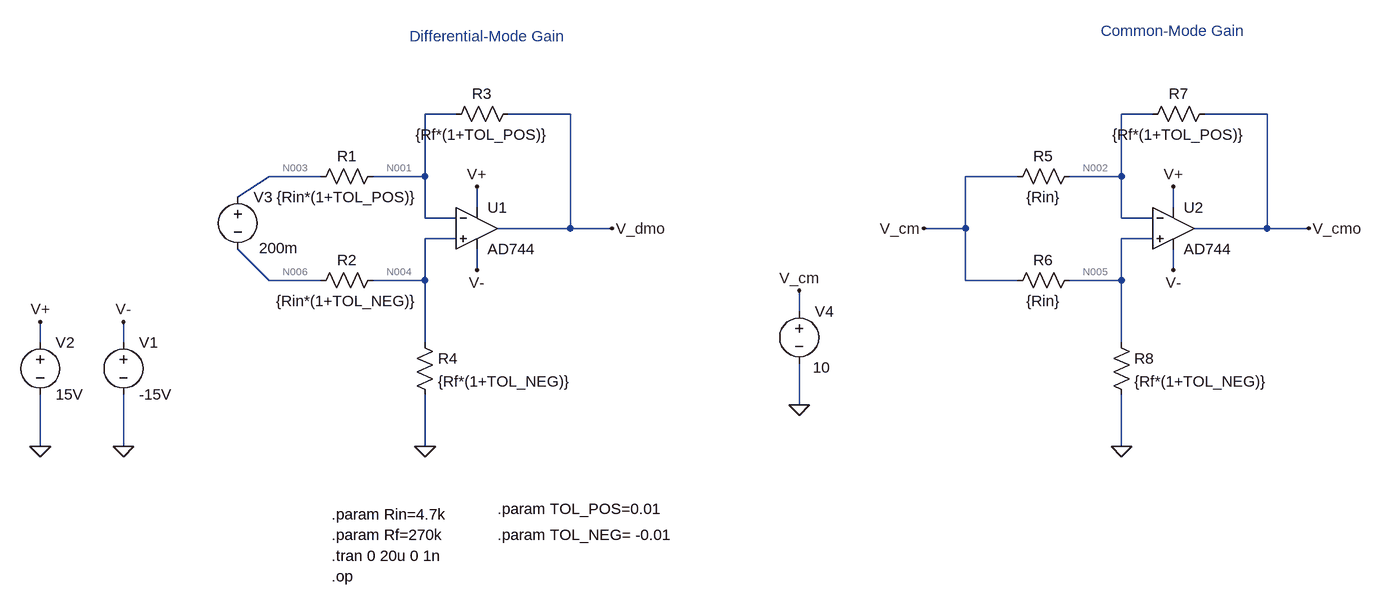
[diagram p0: schematic hw3_p3c_vcm10v_eantunano.asc]
hw3_p3c_vcm10v_eantunano.asc, the LTspice schematic file:
Version 4
SHEET 1 1632 696
WIRE 208 -32 160 -32
WIRE 384 -32 288 -32
WIRE 1280 -32 1232 -32
WIRE 1456 -32 1360 -32
WIRE 0 64 -80 64
WIRE 160 64 160 -32
WIRE 160 64 80 64
WIRE 1072 64 992 64
WIRE 1232 64 1232 -32
WIRE 1232 64 1152 64
WIRE -128 96 -80 64
WIRE 240 112 240 80
WIRE 1312 112 1312 80
WIRE 160 128 160 64
WIRE 208 128 160 128
WIRE 1232 128 1232 64
WIRE 1280 128 1232 128
WIRE 384 144 384 -32
WIRE 384 144 272 144
WIRE 448 144 384 144
WIRE 992 144 992 64
WIRE 992 144 928 144
WIRE 1456 144 1456 -32
WIRE 1456 144 1344 144
WIRE 1520 144 1456 144
WIRE 208 160 160 160
WIRE 1280 160 1232 160
WIRE 240 208 240 176
WIRE 1312 208 1312 176
WIRE -80 224 -128 176
WIRE 0 224 -80 224
WIRE 160 224 160 160
WIRE 160 224 80 224
WIRE 992 224 992 144
WIRE 1072 224 992 224
WIRE 1232 224 1232 160
WIRE 1232 224 1152 224
WIRE 736 272 736 240
WIRE -432 320 -432 288
WIRE -304 320 -304 288
WIRE 160 320 160 224
WIRE 1232 320 1232 224
WIRE 736 416 736 352
WIRE -432 480 -432 400
WIRE -304 480 -304 400
WIRE 160 480 160 400
WIRE 1232 480 1232 400
FLAG 160 480 0
FLAG 448 144 V_dmo
FLAG -304 288 V-
FLAG -432 288 V+
FLAG 240 80 V+
FLAG 240 208 V-
FLAG -304 480 0
FLAG -432 480 0
FLAG 1232 480 0
FLAG 1520 144 V_cmo
FLAG 1312 80 V+
FLAG 1312 208 V-
FLAG 928 144 V_cm
FLAG 736 416 0
FLAG 736 240 V_cm
DATAFLAG 1456 144 ""
DATAFLAG 368 144 ""
SYMBOL OpAmps\\AD744 240 80 R0
SYMATTR InstName U1
SYMBOL res 96 48 R90
WINDOW 0 0 56 VBottom 2
WINDOW 3 32 56 VTop 2
SYMATTR InstName R1
SYMATTR Value {Rin*(1+TOL_POS)}
SYMATTR SpiceLine tol=-0.01
SYMBOL res 96 208 R90
WINDOW 0 0 56 VBottom 2
WINDOW 3 32 56 VTop 2
SYMATTR InstName R2
SYMATTR Value {Rin*(1+TOL_NEG)}
SYMATTR SpiceLine tol=-0.01
SYMBOL res 192 -16 R270
WINDOW 0 32 56 VTop 2
WINDOW 3 0 56 VBottom 2
SYMATTR InstName R3
SYMATTR Value {Rf*(1+TOL_POS)}
SYMATTR SpiceLine tol=+0.01
SYMBOL res 144 304 R0
SYMATTR InstName R4
SYMATTR Value {Rf*(1+TOL_NEG)}
SYMATTR SpiceLine tol=+0.01
SYMBOL voltage -304 304 R0
WINDOW 123 0 0 Left 0
WINDOW 39 0 0 Left 0
SYMATTR InstName V1
SYMATTR Value -15V
SYMBOL voltage -432 304 R0
WINDOW 123 0 0 Left 0
WINDOW 39 0 0 Left 0
SYMATTR InstName V2
SYMATTR Value 15V
SYMBOL OpAmps\\AD744 1312 80 R0
SYMATTR InstName U2
SYMBOL res 1168 48 R90
WINDOW 0 0 56 VBottom 2
WINDOW 3 32 56 VTop 2
SYMATTR InstName R5
SYMATTR Value {Rin}
SYMATTR SpiceLine tol=0
SYMBOL res 1168 208 R90
WINDOW 0 0 56 VBottom 2
WINDOW 3 32 56 VTop 2
SYMATTR InstName R6
SYMATTR Value {Rin}
SYMATTR SpiceLine tol=0
SYMBOL res 1264 -16 R270
WINDOW 0 32 56 VTop 2
WINDOW 3 0 56 VBottom 2
SYMATTR InstName R7
SYMATTR Value {Rf*(1+TOL_POS)}
SYMATTR SpiceLine tol=0
SYMBOL res 1216 304 R0
SYMATTR InstName R8
SYMATTR Value {Rf*(1+TOL_NEG)}
SYMATTR SpiceLine tol=0
SYMBOL voltage 736 256 R0
WINDOW 3 21 102 Left 2
WINDOW 123 24 124 Left 2
WINDOW 39 0 0 Left 0
SYMATTR Value 10
SYMATTR InstName V4
SYMBOL voltage -128 80 R0
WINDOW 3 33 94 Left 2
WINDOW 123 17 106 Left 2
WINDOW 39 0 0 Left 0
SYMATTR Value 200m
SYMATTR InstName V3
TEXT 16 584 Left 2 !.param Rin=4.7k
TEXT 16 616 Left 2 !.param Rf=270k
TEXT 1200 -160 Left 2 ;Common-Mode Gain
TEXT 136 -152 Left 2 ;Differential-Mode Gain
TEXT 16 648 Left 2 !.tran 0 20u 0 1n
TEXT 272 576 Left 2 !.param TOL_POS=0.01
TEXT 272 616 Left 2 !.param TOL_NEG= -0.01
TEXT 16 680 Left 2 !.op

The netlist it stands for:
* hw3_p3c_vcm10v_eantunano.asc
XU1 N004 N001 V+ V- V_dmo AD744  ; pins In+ In- V+ V- OUT
R1 N001 N003 {Rin*(1+TOL_POS)} tol=-0.01
R2 N004 N006 {Rin*(1+TOL_NEG)} tol=-0.01
R3 N001 V_dmo {Rf*(1+TOL_POS)} tol=+0.01
R4 N004 0 {Rf*(1+TOL_NEG)} tol=+0.01
V1 V- 0 -15V
V2 V+ 0 15V
XU2 N005 N002 V+ V- V_cmo AD744  ; pins In+ In- V+ V- OUT
R5 N002 V_cm {Rin} tol=0
R6 N005 V_cm {Rin} tol=0
R7 N002 V_cmo {Rf*(1+TOL_POS)} tol=0
R8 N005 0 {Rf*(1+TOL_NEG)} tol=0
V4 V_cm 0 10
V3 N003 N006 200m
.param Rin=4.7k
.param Rf=270k
* Common-Mode Gain
* Differential-Mode Gain
.tran 0 20u 0 1n
.param TOL_POS=0.01
.param TOL_NEG= -0.01
.op
.backanno
.end

* Results of the author's LTspice run, read from the files saved beside the schematic
* Operating Point, zero values left out:
*   V(n001) = -5.686 V
*   V(n004) = -5.686 V
*   V(v+) = 15 V
*   V(v_dmo) = -11.49 V
*   V(v-) = -15 V
*   V(n003) = -5.585 V
*   V(n006) = -5.785 V
*   V(n002) = 9.827 V
*   V(n005) = 9.827 V
*   V(v_cmo) = -198.5 mV
*   V(v_cm) = 10 V
*   I(R8) = 36.76 µA
*   I(R7) = 36.76 µA
*   I(R6) = -36.77 µA
*   I(R5) = -36.76 µA
*   I(R4) = -21.27 µA
*   I(R3) = 21.27 µA
*   I(R2) = 21.27 µA
*   I(R1) = -21.27 µA
*   I(V3) = -21.27 µA
*   I(V4) = -73.53 µA
*   I(V2) = -9.769 mA
*   I(V1) = 9.827 mA
*   Ix(u1:1) = -71.96 pA
*   Ix(u1:2) = -71.96 pA
*   Ix(u1:3) = 4.888 mA
*   Ix(u1:4) = -4.909 mA
*   Ix(u1:5) = 21.27 µA
*   Ix(u2:1) = 424.5 pA
*   Ix(u2:2) = 424.5 pA
*   Ix(u2:3) = 4.881 mA
*   Ix(u2:4) = -4.918 mA
*   Ix(u2:5) = 36.76 µA